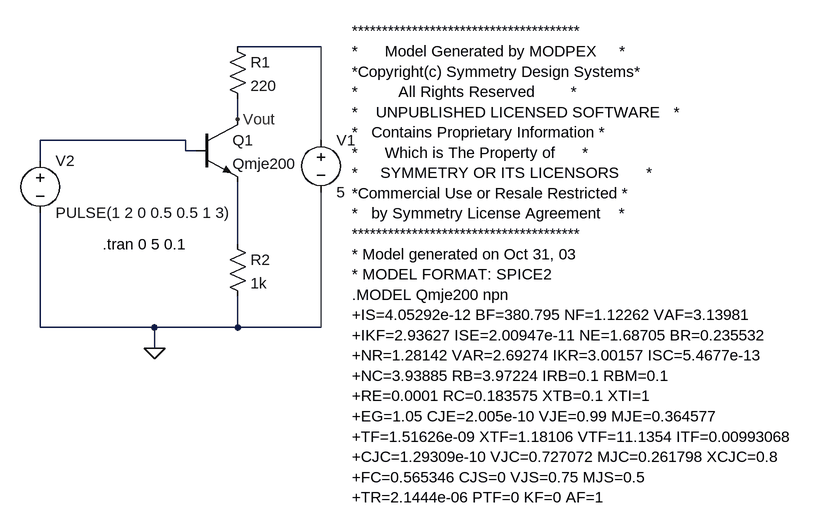
[diagram p0: schematic Draft12.asc]
Draft12.asc, the LTspice schematic file:
Version 4
SHEET 1 1288 680
WIRE 528 96 400 96
WIRE 400 208 400 176
WIRE 320 240 96 240
WIRE 528 240 528 96
WIRE 320 256 320 240
WIRE 336 256 320 256
WIRE 96 272 96 240
WIRE 400 400 400 304
WIRE 96 528 96 352
WIRE 272 528 96 528
WIRE 400 528 400 480
WIRE 400 528 272 528
WIRE 528 528 528 320
WIRE 528 528 400 528
WIRE 272 560 272 528
FLAG 272 560 0
FLAG 400 208 Vout
SYMBOL npn 336 208 R0
SYMATTR InstName Q1
SYMATTR Value Qmje200
SYMBOL res 384 80 R0
SYMATTR InstName R1
SYMATTR Value 220
SYMBOL res 384 384 R0
SYMATTR InstName R2
SYMATTR Value 1k
SYMBOL voltage 528 224 R0
SYMATTR InstName V1
SYMATTR Value 5
SYMBOL voltage 96 256 R0
SYMATTR InstName V2
SYMATTR Value PULSE(1 2 0 0.5 0.5 1 3)
TEXT 576 72 Left 2 !**************************************\n*      Model Generated by MODPEX     *\n*Copyright(c) Symmetry Design Systems*\n*         All Rights Reserved        *\n*    UNPUBLISHED LICENSED SOFTWARE   *\n*   Contains Proprietary Information *\n*      Which is The Property of      *\n*     SYMMETRY OR ITS LICENSORS      *\n*Commercial Use or Resale Restricted *\n*   by Symmetry License Agreement    *\n**************************************\n* Model generated on Oct 31, 03\n* MODEL FORMAT: SPICE2\n.MODEL Qmje200 npn\n+IS=4.05292e-12 BF=380.795 NF=1.12262 VAF=3.13981\n+IKF=2.93627 ISE=2.00947e-11 NE=1.68705 BR=0.235532\n+NR=1.28142 VAR=2.69274 IKR=3.00157 ISC=5.4677e-13\n+NC=3.93885 RB=3.97224 IRB=0.1 RBM=0.1\n+RE=0.0001 RC=0.183575 XTB=0.1 XTI=1\n+EG=1.05 CJE=2.005e-10 VJE=0.99 MJE=0.364577\n+TF=1.51626e-09 XTF=1.18106 VTF=11.1354 ITF=0.00993068\n+CJC=1.29309e-10 VJC=0.727072 MJC=0.261798 XCJC=0.8\n+FC=0.565346 CJS=0 VJS=0.75 MJS=0.5\n+TR=2.1444e-06 PTF=0 KF=0 AF=1
TEXT 192 400 Left 2 !.tran 0 5 0.1

The netlist it stands for:
* Draft12.asc
Q1 Vout N002 N003 0 Qmje200
R1 N001 Vout 220
R2 N003 0 1k
V1 N001 0 5
V2 N002 0 PULSE(1 2 0 0.5 0.5 1 3)
.model NPN NPN
.model PNP PNP
.lib standard.bjt
**************************************
*      Model Generated by MODPEX     *
*Copyright(c) Symmetry Design Systems*
*         All Rights Reserved        *
*    UNPUBLISHED LICENSED SOFTWARE   *
*   Contains Proprietary Information *
*      Which is The Property of      *
*     SYMMETRY OR ITS LICENSORS      *
*Commercial Use or Resale Restricted *
*   by Symmetry License Agreement    *
**************************************
* Model generated on Oct 31, 03
* MODEL FORMAT: SPICE2
.MODEL Qmje200 npn
+IS=4.05292e-12 BF=380.795 NF=1.12262 VAF=3.13981
+IKF=2.93627 ISE=2.00947e-11 NE=1.68705 BR=0.235532
+NR=1.28142 VAR=2.69274 IKR=3.00157 ISC=5.4677e-13
+NC=3.93885 RB=3.97224 IRB=0.1 RBM=0.1
+RE=0.0001 RC=0.183575 XTB=0.1 XTI=1
+EG=1.05 CJE=2.005e-10 VJE=0.99 MJE=0.364577
+TF=1.51626e-09 XTF=1.18106 VTF=11.1354 ITF=0.00993068
+CJC=1.29309e-10 VJC=0.727072 MJC=0.261798 XCJC=0.8
+FC=0.565346 CJS=0 VJS=0.75 MJS=0.5
+TR=2.1444e-06 PTF=0 KF=0 AF=1
.tran 0 5 0.1
.backanno
.end